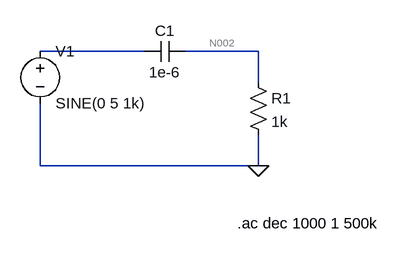
[diagram p0: schematic highpass.asc]
highpass.asc, the LTspice schematic file:
Version 4
SHEET 1 880 680
WIRE 336 336 176 336
WIRE 512 336 400 336
WIRE 512 384 512 336
WIRE 176 512 176 416
WIRE 512 512 512 464
WIRE 512 512 176 512
FLAG 512 512 0
SYMBOL voltage 176 320 R0
SYMATTR InstName V1
SYMATTR Value SINE(0 5 1k)
SYMATTR Value2 AC 1 0
SYMBOL cap 400 320 R90
WINDOW 0 0 32 VBottom 2
WINDOW 3 32 32 VTop 2
SYMATTR InstName C1
SYMATTR Value 1e-6
SYMBOL res 496 368 R0
SYMATTR InstName R1
SYMATTR Value 1k
TEXT 480 600 Left 2 !.ac dec 1000 1 500k

The netlist it stands for:
* highpass.asc
V1 N001 0 SINE(0 5 1k) AC 1 0
C1 N002 N001 1e-6
R1 N002 0 1k
.ac dec 1000 1 500k
.backanno
.end

* Results of the author's LTspice run, read from the files saved beside the schematic
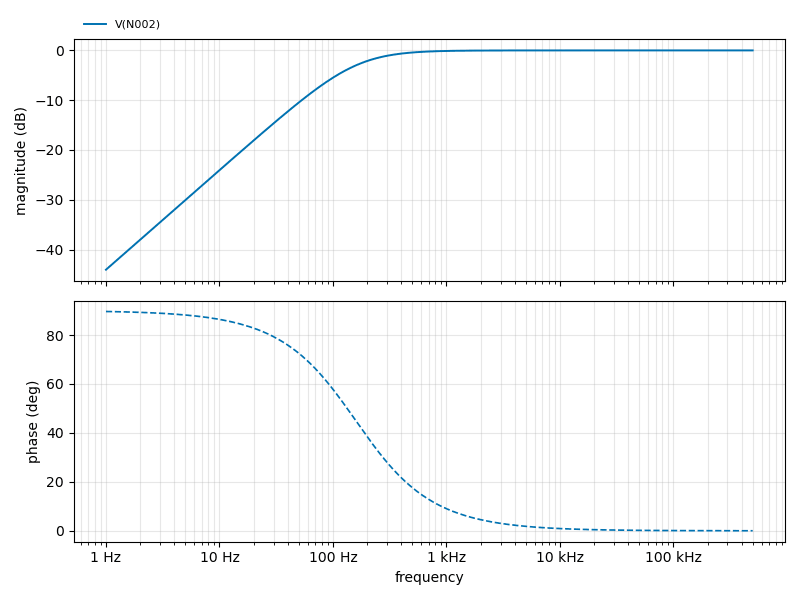
[diagram p1: AC Analysis of highpass.asc, plotted from the saved traces]
* AC Analysis, 1 run:
*   V(N002): -44.04 dB at 1 Hz, -0.00 dB at 500 kHz, peak -0.00 dB at 500 kHz, 3 dB below the peak at 159.2 Hz